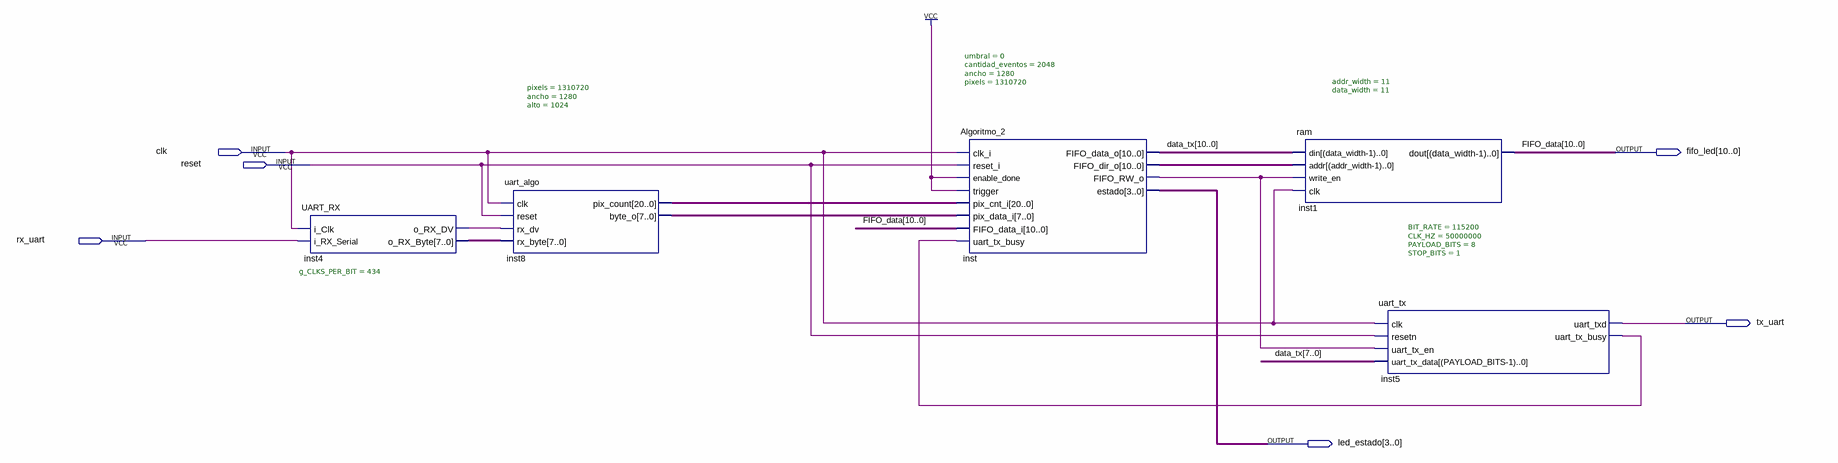
[diagram p0: schematic sheet]
// Quartus schematic top_3.bdf as structural Verilog: 5 symbols, 6 pins
module top_3 (
  input  clk,
  input  reset,
  input  rx_uart,
  output [10:0] fifo_led,
  output tx_uart,
  output [3:0] led_estado
);

  wire inst4_o_rx_dv, inst5_uart_tx_busy, inst_fifo_rw_o;
  wire [7:0] inst4_o_rx_byte, inst8_byte_o;
  wire [10:0] data_tx, inst_fifo_dir_o;
  wire [20:0] inst8_pix_count;

  UART_RX #(.g_CLKS_PER_BIT(434)) inst4 (
    .i_Clk(clk), .i_RX_Serial(rx_uart), .o_RX_DV(inst4_o_rx_dv), .o_RX_Byte(inst4_o_rx_byte));
  uart_algo #(.pixels(1310720), .ancho(1280), .alto(1024)) inst8 (
    .clk(clk), .reset(reset), .rx_dv(inst4_o_rx_dv), .rx_byte(inst4_o_rx_byte), .pix_count(inst8_pix_count),
    .byte_o(inst8_byte_o));
  Algoritmo_2 #(.umbral(0), .cantidad_eventos(2048), .ancho(1280), .pixels(1310720)) inst (
    .clk_i(clk), .reset_i(reset), .enable_done(1'b1), .trigger(1'b1), .pix_cnt_i(inst8_pix_count),
    .pix_data_i(inst8_byte_o), .FIFO_data_i(fifo_led), .uart_tx_busy(inst5_uart_tx_busy),
    .FIFO_data_o(data_tx), .FIFO_dir_o(inst_fifo_dir_o), .FIFO_RW_o(inst_fifo_rw_o), .estado(led_estado));
  ram #(.addr_width(11), .data_width(11)) inst1 (
    .din(data_tx), .addr(inst_fifo_dir_o), .write_en(inst_fifo_rw_o), .clk(clk), .dout(fifo_led));
  uart_tx #(.BIT_RATE(115200), .CLK_HZ(50000000), .PAYLOAD_BITS(8), .STOP_BITS(1)) inst5 (
    .clk(clk), .resetn(reset), .uart_tx_en(inst_fifo_rw_o), .uart_tx_data(data_tx[7:0]), .uart_txd(tx_uart),
    .uart_tx_busy(inst5_uart_tx_busy));

  // Other names for the same wires on the sheet: FIFO_data[10:0] = fifo_led
endmodule
